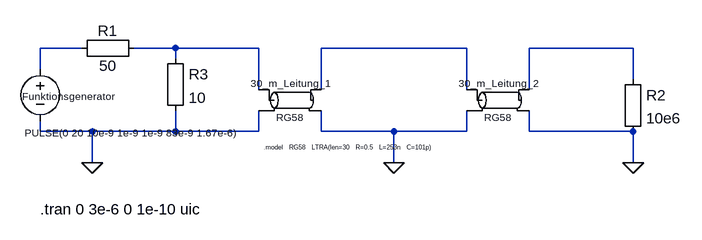
[diagram p0: schematic V5 Impulse auf Leitungen 2.asc]
V5 Impulse auf Leitungen 2.asc, the LTspice schematic file:
Version 4
SHEET 1 880 680
WIRE -528 -96 -592 -96
WIRE -384 -96 -448 -96
WIRE -256 -96 -384 -96
WIRE 64 -96 -160 -96
WIRE 320 -96 160 -96
WIRE -384 -80 -384 -96
WIRE -592 -64 -592 -96
WIRE 320 -48 320 -96
WIRE -256 -32 -256 -96
WIRE -160 -32 -160 -96
WIRE 64 -32 64 -96
WIRE 160 -32 160 -96
WIRE -592 32 -592 16
WIRE -512 32 -592 32
WIRE -384 32 -384 0
WIRE -384 32 -512 32
WIRE -256 32 -256 0
WIRE -256 32 -384 32
WIRE -160 32 -160 0
WIRE -48 32 -160 32
WIRE 64 32 64 0
WIRE 64 32 -48 32
WIRE 160 32 160 0
WIRE 320 32 160 32
WIRE -512 80 -512 32
WIRE -48 80 -48 32
WIRE 320 80 320 32
FLAG -512 80 0
FLAG -48 80 0
FLAG 320 80 0
SYMBOL voltage -592 -80 R0
WINDOW 123 0 0 Left 0
WINDOW 39 0 0 Left 0
WINDOW 3 -24 114 Left 1
WINDOW 0 -28 58 Left 1
SYMATTR Value PULSE(0 20 10e-9 1e-9 1e-9 83e-9 1.67e-6)
SYMATTR InstName Funktionsgenerator
SYMBOL ltline -208 -16 R0
WINDOW 0 0 -16 Bottom 1
WINDOW 3 0 16 Top 1
SYMATTR InstName 30_m_Leitung_1
SYMATTR Value RG58
SYMBOL ltline 112 -16 R0
WINDOW 0 0 -16 Bottom 1
WINDOW 3 0 16 Top 1
SYMATTR InstName 30_m_Leitung_2
SYMATTR Value RG58
SYMBOL Misc\\EuropeanResistor -400 -96 R0
SYMATTR InstName R3
SYMATTR Value 10
SYMBOL Misc\\EuropeanResistor 304 -64 R0
SYMATTR InstName R2
SYMATTR Value 10e6
SYMBOL Misc\\EuropeanResistor -432 -112 R90
WINDOW 0 5 56 VBottom 2
WINDOW 3 27 56 VTop 2
SYMATTR InstName R1
SYMATTR Value 50
TEXT -592 152 Left 2 !.tran 0 3e-6 0 1e-10 uic
TEXT -248 56 Left 0 !.model   RG58   LTRA(len=30   R=0.5   L=253n   C=101p)

The netlist it stands for:
* V5 Impulse auf Leitungen 2.asc
V§Funktionsgenerator N001 0 PULSE(0 20 10e-9 1e-9 1e-9 83e-9 1.67e-6)
O§30_m_Leitung_1 N002 0 N003 0 RG58
O§30_m_Leitung_2 N003 0 N004 0 RG58
R3 N002 0 10
R2 N004 0 10e6
R1 N002 N001 50
.tran 0 3e-6 0 1e-10 uic
.model   RG58   LTRA(len=30   R=0.5   L=253n   C=101p)
.backanno
.end